# EAGLE design os22_rev_diy (EAGLE 7.1.0)
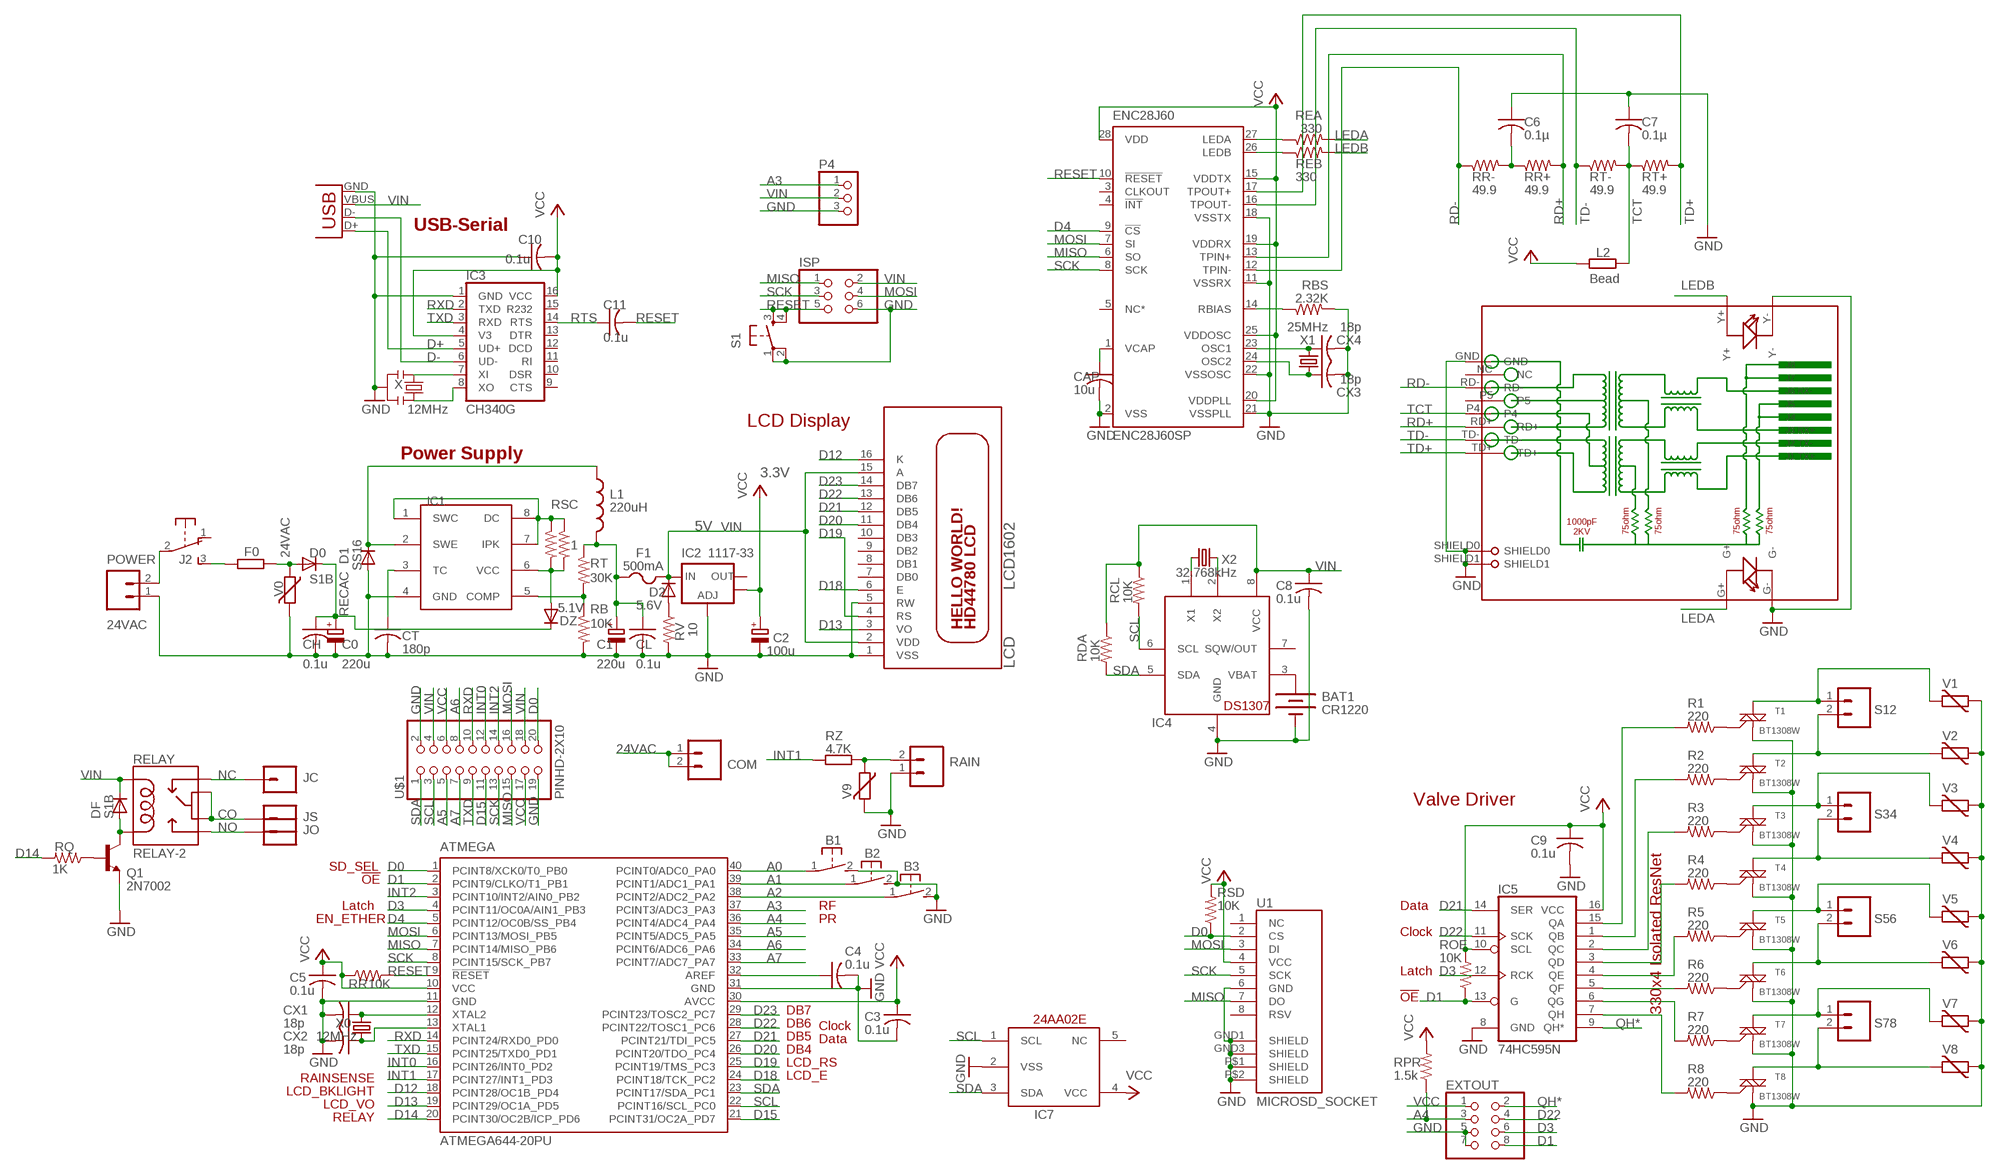
[diagram p0: schematic, sheet 1]

## Parts
ATMEGA  ATMEGA644-20PU  [DIL40]
B1  31-XX  [B3F-31XX]
B2  31-XX  [B3F-31XX]
B3  31-XX  [B3F-31XX]
BAT1  CR1220  BATTERYBATTERY_12MM_SMT  [BATTCON_12MM_SMT]
C0  220u  CPOL-EUE3.5-8  [E3,5-8]
C1  220u  CPOL-EUE3.5-8  [E3,5-8]
C2  100u  CPOL-EUE2-5  [E2-5]
C3  0.1u  C-USC0603K  [C0603K]
C4  0.1u  C-USC0603K  [C0603K]
C5  0.1u  C-USC0603K  [C0603K]
C6  0.1µ  C-USC0603K  [C0603K]
C7  0.1µ  C-USC0603K  [C0603K]
C8  0.1u  C-USC0603K  [C0603K]
C9  0.1u  C-USC0603K  [C0603K]
C10  0.1u  C-USC0603K  [C0603K]
C11  0.1u  C-USC0603K  [C0603K]
CAP  10u  C-USC0805K  [C0805K]
CH  0.1u  C-USC0603K  [C0603K]
CL  0.1u  C-USC0603K  [C0603K]
COM  M025MM-X  [SCREWTERMINAL-5MM-2-X]
CT  180p  C-USC0603K  [C0603K]
CX1  18p  C-USC0603K  [C0603K]
CX2  18p  C-USC0603K  [C0603K]
CX3  18p  C-USC0603K  [C0603K]
CX4  18p  C-USC0603K  [C0603K]
D0  S1B  DIODE-DO-214AC  [DO-214AC]
D1  SS16  DIODE-DO-214AC  [DO-214AC]
D2  5.6V  DIODE-MINIMELF  [MINIMELF]
DF  S1B  DIODE-DO-214AC  [DO-214AC]
DZ  5.1V  DIODE-MELF-MLL41  [MELF-MLL41]
ENC28J60  ENC28J60SP  [DIL28-3]
EXTOUT  PINHD-2X4  [2X04]
F0  R-EU_0411/3V  [0411V]
F1  500mA  PTCFUSE-1812  [1812]
IC1  34063  MC33063/MC34063D  [SO08]
IC2  1117-33  V_REG_LM1117SOT223  [SOT223]
IC3  CH340G  [SO16]
IC4  DS1307  DS1307SOIC  [SO08]
IC5  74HC595N  74LS595D  [SO16]
IC7  24AA02E  24AA02E48  [SOT23-5L]
ISP  PINHD-2X3  [2X03]
J2  EG1206  [EG1206]
JC  M01PTH  [1X01]
JO  M01PTH  [1X01]
JS  M01PTH  [1X01]
L1  220uH  L-US0204/5  [0204/5]
L2  Bead  R-EU_R0805  [R0805]
LCD  LCD1602  HD44780LCDNOHOLE  [LCD1602A]
P4  PINHD-1X3  [1X03]
POWER  24VAC  M024MM-X  [SCREWTERMINAL-4MM-2-X]
Q1  2N7002  TRANSISTOR_NPNSOT23-3  [SOT23-3]
R1  220  R-US_R0603  [R0603]
R2  220  R-US_R0603  [R0603]
R3  220  R-US_R0603  [R0603]
R4  220  R-US_R0603  [R0603]
R5  220  R-US_R0603  [R0603]
R6  220  R-US_R0603  [R0603]
R7  220  R-US_R0603  [R0603]
R8  220  R-US_R0603  [R0603]
RAIN  M025MM-X  [SCREWTERMINAL-5MM-2-X]
RB  10K  R-US_R0805  [R0805]
RBS  2.32K  R-US_R0805  [R0805]
RCL  10K  R-US_R0603  [R0603]
RDA  10K  R-US_R0603  [R0603]
REA  330  R-US_R0603  [R0603]
REB  330  R-US_R0603  [R0603]
RELAY  RELAY-2  [RELAY-HK4100F]
RJ45  HR911105A  [HR911105A]
ROE  10K  R-US_R0603  [R0603]
RPR  1.5k  R-US_R0603  [R0603]
RQ  1K  R-US_R0603  [R0603]
RR  10K  R-US_R0603  [R0603]
RR+  49.9  R-US_R0805  [R0805]
RR-  49.9  R-US_R0805  [R0805]
RSC  1  R-US_R0805  [R0805]
RSC1  1  R-US_R0805  [R0805]
RSD  10K  R-US_R0603  [R0603]
RT  30K  R-US_R0805  [R0805]
RT+  49.9  R-US_R0805  [R0805]
RT-  49.9  R-US_R0805  [R0805]
RV  10  R-US_R0805  [R0805]
RZ  4.7K  R-EU_R0805  [R0805]
S1  TAC_SWITCHPTH  [TACTILE-PTH]
S12  M025MM-X  [SCREWTERMINAL-5MM-2-X]
S34  M025MM-X  [SCREWTERMINAL-5MM-2-X]
S56  M025MM-X  [SCREWTERMINAL-5MM-2-X]
S78  M025MM-X  [SCREWTERMINAL-5MM-2-X]
T1  BT1308W  MAC97  [TO-92]
T2  BT1308W  MAC97  [TO-92]
T3  BT1308W  MAC97  [TO-92]
T4  BT1308W  MAC97  [TO-92]
T5  BT1308W  MAC97  [TO-92]
T6  BT1308W  MAC97  [TO-92]
T7  BT1308W  MAC97  [TO-92]
T8  BT1308W  MAC97  [TO-92]
U1  MICROSD_SOCKET  USD-SOCKETMICRO-SD-SOCKET-TAOBAO  [MICRO-SD-SOCKET-TAOBAO]
U$1  PINHD-2X10  [2X10-CLEANBIG]
USB  USBPTH  [USB-B-PTH]
V0  MOV  VARISTOR-5  [R-5]
V1  MOV  VARISTOR-5  [R-5]
V2  MOV  VARISTOR-5  [R-5]
V3  MOV  VARISTOR-5  [R-5]
V4  MOV  VARISTOR-5  [R-5]
V5  MOV  VARISTOR-5  [R-5]
V6  MOV  VARISTOR-5  [R-5]
V7  MOV  VARISTOR-5  [R-5]
V8  MOV  VARISTOR-5  [R-5]
V9  MOV  VARISTOR-5  [R-5]
X  12MHz  RESONATORSMD  [RESONATOR-SMD]
X0  12MHz  CRYSTALHC49UV  [HC49U-V]
X1  25MHz  CRYSTALHC49UV  [HC49U-V]
X2  32.768kHz  CRYSTALTC38H  [TC38H]

## Nets
24VAC [power]: COM.1 COM.2 D0.A F0.2 V0.1
A0: ATMEGA.40(PCINT0/ADC0_PA0) B1.1(P)
A1: ATMEGA.39(PCINT1/ADC1_PA1) B2.1(P)
A2: ATMEGA.38(PCINT2/ADC2_PA2) B3.1(P)
A3: ATMEGA.37(PCINT3/ADC3_PA3) P4.1
A4: ATMEGA.36(PCINT4/ADC4_PA4) EXTOUT.3 RPR.1
A5: ATMEGA.35(PCINT5/ADC5_PA5) U$1.5
A6: ATMEGA.34(PCINT6/ADC6_PA6) U$1.8
A7: ATMEGA.33(PCINT7/ADC7_PA7) U$1.7
AREF: ATMEGA.32(AREF) C4.1
CO [relaypower]: JS.1 RELAY.5 RELAY.6
D0: ATMEGA.1(PCINT8/XCK0/T0_PB0) RSD.1 U1.2(CS) U$1.20
D1: ATMEGA.2(PCINT9/CLKO/T1_PB1) EXTOUT.8 IC5.13(G) ROE.1
D3: ATMEGA.4(PCINT11/OC0A/AIN1_PB3) EXTOUT.6 IC5.12(RCK)
D4: ATMEGA.5(PCINT12/OC0B/SS_PB4) ENC28J60.9(!CS)
D12: ATMEGA.18(PCINT28/OC1B_PD4) LCD.16(K)
D13: ATMEGA.19(PCINT29/OC1A_PD5) LCD.3(VO)
D14: ATMEGA.20(PCINT30/OC2B/ICP_PD6) RQ.2
D15: ATMEGA.21(PCINT31/OC2A_PD7) U$1.11
D18: ATMEGA.24(PCINT18/TCK_PC2) LCD.6(E)
D19: ATMEGA.25(PCINT19/TMS_PC3) LCD.4(RS)
D20: ATMEGA.26(PCINT20/TDO_PC4) LCD.11(DB4)
D21: ATMEGA.27(PCINT21/TDI_PC5) IC5.14(SER) LCD.12(DB5)
D22: ATMEGA.28(PCINT22/TOSC1_PC6) EXTOUT.4 IC5.11(SCK) LCD.13(DB6)
D23: ATMEGA.29(PCINT23/TOSC2_PC7) LCD.14(DB7)
D+: IC3.5(UD+) USB.D+
D-: IC3.6(UD-) USB.D-
GND [power]: ATMEGA.11(GND) ATMEGA.31(GND) B1.2(S) B2.2(S) B3.2(S) BAT1.P$1(-) C0.- C1.- C2.- C3.2 C4.2 C5.2 C6.1 C7.1 C8.2 C9.2 C10.1 CAP.2 CH.2 CL.2 CT.2 CX1.2 CX2.2 CX3.2 CX4.2 D1.A ENC28J60.2(VSS) ENC28J60.11(VSSRX) ENC28J60.18(VSSTX) ENC28J60.21(VSSPLL) ENC28J60.22(VSSOSC) EXTOUT.5 EXTOUT.7 IC1.4(GND) IC2.1(ADJ) IC3.1(GND) IC4.4(GND) IC5.8(GND) IC7.2(VSS) ISP.6 LCD.1(VSS) LCD.5(RW) P4.3 POWER.1 Q1.2(E) RAIN.1 RB.2 RBS.2 RJ45.G- RJ45.GND RJ45.SHIELD0 RJ45.SHIELD1 RJ45.Y- RV.2 S1.1 S1.2 T1.1(M1) T2.1(M1) T3.1(M1) T4.1(M1) T5.1(M1) T6.1(M1) T7.1(M1) T8.1(M1) U1.6(GND) U1.GND1(SHIELD) U1.GND3(SHIELD) U1.P$1(SHIELD) U1.P$2(SHIELD) U$1.2 U$1.19 USB.GND V0.2 V1.1 V2.1 V3.1 V4.1 V5.1 V6.1 V7.1 V8.1 V9.2 X.2
INT0: ATMEGA.16(PCINT26/INT0_PD2) U$1.12
INT1: ATMEGA.17(PCINT27/INT1_PD3) RZ.2
INT2: ATMEGA.3(PCINT10/INT2/AIN0_PB2) U$1.14
LEDA: REA.2 RJ45.G+
LEDB: REB.2 RJ45.Y+
MISO: ATMEGA.7(PCINT14/MISO_PB6) ENC28J60.6(SO) ISP.1 U1.7(DO) U$1.15
MOSI: ATMEGA.6(PCINT13/MOSI_PB5) ENC28J60.7(SI) ISP.4 U1.3(DI) U$1.16
N$1: IC4.2(X2) X2.2
N$2: IC4.1(X1) X2.1
N$3: R1.1 T1.2(G)
N$4: IC5.5(QF) R6.2
N$5: IC5.6(QG) R7.2
N$6 [power]: J2.2(P) POWER.2
N$7: IC5.7(QH) R8.2
N$8: BAT1.P$2(+) IC4.3(VBAT)
N$9 [power]: D1.C IC1.2(SWE) L1.1
N$10: IC5.4(QE) R5.2
N$11: IC5.3(QD) R4.2
N$12: IC5.2(QC) R3.2
N$13: IC5.1(QB) R2.2
N$14: IC5.15(QA) R1.2
N$15: R2.1 T2.2(G)
N$16 [power]: S12.1 T1.3(M2) V1.2
N$17 [power]: S12.2 T2.3(M2) V2.2
N$18 [power]: S34.1 T3.3(M2) V3.2
N$19: ENC28J60.14(RBIAS) RBS.1
N$20 [power]: S34.2 T4.3(M2) V4.2
N$21: R3.1 T3.2(G)
N$22 [power]: S56.1 T5.3(M2) V5.2
N$23 [power]: S56.2 T6.3(M2) V6.2
N$24 [power]: S78.1 T7.3(M2) V7.2
N$25 [power]: S78.2 T8.3(M2) V8.2
N$26: R4.1 T4.2(G)
N$27: R5.1 T5.2(G)
N$28: R6.1 T6.2(G)
N$29: R7.1 T7.2(G)
N$31: RAIN.2 RZ.1 V9.1
N$32 [power]: F0.1 J2.3(S)
N$33: CAP.1 ENC28J60.1(VCAP)
N$34: ENC28J60.27(LEDA) REA.1
N$35: DF.A Q1.3(C) RELAY.9
N$37: ENC28J60.26(LEDB) REB.1
N$38 [power]: DZ.A IC1.6(VCC) RSC1.2 RSC.2
N$39: D2.A RV.1
N$40: Q1.1(B) RQ.1
N$41: CX3.1 ENC28J60.24(OSC2) X1.2
N$42: CX4.1 ENC28J60.23(OSC1) X1.1
N$43: R8.1 T8.2(G)
N$44: IC3.7(XI) X.1
N$45 [power]: IC1.1(SWC) IC1.7(IPK) IC1.8(DC) RSC1.1 RSC.1
N$46: ATMEGA.12(XTAL2) CX1.1 X0.2
N$47: ATMEGA.13(XTAL1) CX2.1 X0.1
N$48: IC3.8(XO) X.3
N$49: CT.1 IC1.3(TC)
N$54: C6.2 RR+.1 RR-.2
N$55: IC1.5(COMP) RB.1 RT.2
NC [relaypower]: JC.1 RELAY.1
NO [relaypower]: JO.1 RELAY.10
QH*: EXTOUT.2 IC5.9(QH*)
RD+: ENC28J60.13(TPIN+) RJ45.RD+ RR+.2
RD-: ENC28J60.12(TPIN-) RJ45.RD- RR-.1
RECAC [power]: C0.+ CH.1 D0.C DZ.C
RESET: ATMEGA.9(!RESET) C11.2 ENC28J60.10(!RESET) ISP.5 RR.2 S1.3 S1.4
RTS: C11.1 IC3.14(RTS)
RXD: ATMEGA.14(PCINT24/RXD0_PD0) IC3.2(TXD) U$1.10
SCK: ATMEGA.8(PCINT15/SCK_PB7) ENC28J60.8(SCK) ISP.3 U1.5(SCK) U$1.13
SCL: ATMEGA.22(PCINT16/SCL_PC0) IC4.6(SCL) IC7.1(SCL) RCL.2 U$1.3
SDA: ATMEGA.23(PCINT17/SDA_PC1) IC4.5(SDA) IC7.3(SDA) RDA.2 U$1.1
TCT: C7.2 L2.1 RJ45.P4 RT+.1 RT-.2
TD+: ENC28J60.17(TPOUT+) RJ45.TD+ RT+.2
TD-: ENC28J60.16(TPOUT-) RJ45.TD- RT-.1
TXD: ATMEGA.15(PCINT25/TXD0_PD1) IC3.3(RXD) U$1.9
VCC: ATMEGA.10(VCC) ATMEGA.30(AVCC) C2.+ C3.1 C5.1 C9.1 C10.2 ENC28J60.15(VDDTX) ENC28J60.19(VDDRX) ENC28J60.20(VDDPLL) ENC28J60.25(VDDOSC) ENC28J60.28(VDD) EXTOUT.1 IC2.4(OUT) IC3.4(V3) IC3.16(VCC) IC5.10(SCL) IC5.16(VCC) IC7.4(VCC) L2.2 ROE.2 RPR.2 RR.1 RSD.2 U1.4(VCC) U$1.6 U$1.17
VIN [power]: C8.1 D2.C DF.C F1.2 IC2.3(IN) IC4.8(VCC) ISP.2 LCD.2(VDD) LCD.15(A) P4.2 RCL.1 RDA.1 RELAY.2 U$1.4 U$1.18 USB.VBUS
VIN1 [power]: C1.+ CL.1 F1.1 L1.2 RT.1
Unconnected: ENC28J60.3(CLKOUT) ENC28J60.4(!INT) ENC28J60.5(NC*) IC2.2(OUT) IC3.9(CTS) IC3.10(DSR) IC3.11(RI) IC3.12(DCD) IC3.13(DTR) IC3.15(R232) IC4.7(SQW/OUT) IC7.5(NC) J2.1(O) LCD.7(DB0) LCD.8(DB1) LCD.9(DB2) LCD.10(DB3) RJ45.NC RJ45.P5 U1.1(NC) U1.8(RSV)

## Notes on the sheet
- USB-Serial
- LCD Display
- Power Supply
- 3.3V
- 5V
- Valve Driver
- SD_SEL
- !OE
- Latch | RF | Data
- EN_ETHER | PR
- Clock
- Latch
- !OE
- DB7 | 330x4 Isolated ResNet
- Clock
- DB6
- Data
- DB5
- DB4
- LCD_RS
- RAINSENSE
- LCD_E
- LCD_BKLIGHT
- LCD_VO
- RELAY

## Library data of the parts
ATMEGA = atmel:ATMEGA644-*PU: 8-bit Microcontroller with 64K Bytes In-System Programmable Flash Auto generated by make-symbol-device-package-bsdl.ulp Rev. 34 Source: http://www.atmel.com/dyn/resources/prod_documents/doc2593.pdf; MPN: ATMEGA644-20PU; OC_FARNELL: 1288340; OC_NEWARK: 23M5060
B1-B3 = adafruit:31-XX: OMRON SWITCH Now with beefier pads!
BAT1 = SparkFunNew:BATTERY: Battery Holders Various common sizes : AA, AAA, 20mm coin cell and 12mm coin cell.
C0 C1 C2 = resistor:CPOL-EU: POLARIZED CAPACITOR, European symbol
C3-C9 CAP CH CL CX1-CX4 = adafruit2013:C-US: CAPACITOR, American symbol
C10 C11 CT = adafruit:C-US: CAPACITOR, American symbol
COM POWER RAIN S12 S34 S56 S78 = SparkFun:M02: Header 2 Standard 2-pin 0.1" header. Use with straight break away headers (SKU : PRT-00116), right angle break away headers (PRT-00553), swiss pins (PRT-00743), machine pins (PRT-00117), and female headers (PRT-00115). Molex polarized connector foot print use with SKU : PRT-08233 with associated crimp pins and housings.
D0 D1 D2 DF DZ = diode:DIODE-: DIODE
ENC28J60 = microchip:ENC28J60: Stand-Alone Ethernet Controller with SPI Interface Source: http://ww1.microchip.com/downloads/en/DeviceDoc/39662c.pdf; MF: MICROCHIP; MPN: ENC28J60/SP; OC_FARNELL: 1084619; OC_NEWARK: 96K3661
EXTOUT = pinhead:PINHD-2X4: PIN HEADER
F0 L2 RZ = rcl:R-EU_: RESISTOR, European symbol
F1 = adafruit:PTCFUSE: PTC fuses, resettable thermistors
IC1 = adafruit:MC33063/MC34063: MC33063 and MC34063 Basic DC/DC converter with internal power-NPN transistor, 100KHz, 1.5A peak switch current. 3-40 input/output.
IC2 = SparkFun:V_REG_LM1117: Voltage Regulator LM1117 Standard adjustable voltage regulator but in SMD form. Spark Fun Electronics SKU : COM-00595
IC3 = SparkFunNew:CH340
IC4 = adafruit:DS1307: DS1307 Real time clock (RTC) with battery backup ability. Talk to it via i2c
IC5 = SparkFun:74*595: 8-bit SHIFT REGISTER, output latch
IC7 = adafruit:24AA02E48
ISP = pinhead:PINHD-2X3: PIN HEADER
J2 = adafruit:EG1206
JC JO JS = SparkFun:M01: Header 1 Standard 1-pin 0.1" header. Use with straight break away headers (SKU : PRT-00116), right angle break away headers (PRT-00553), swiss pins (PRT-00743), machine pins (PRT-00117), and female headers (PRT-00115).
L1 = rcl:L-US: INDUCTOR, American symbol
LCD = adafruit:HD44780LCD: HD44780 LCD Standard character type LCDs, available in sizes from 8x1 to 40x4!
P4 = pinhead:PINHD-1X3: PIN HEADER
Q1 = SparkFunNew:TRANSISTOR_NPN: Transistor NPN BJT configuration in SOT23 package. MMBT2222 is the common NPN we use. Double check BCE configuration again layout.
R1-R7 RCL RDA ROE RPR RQ RR RSD RV = adafruit:R-US_: RESISTOR, American symbol
R8 RBS REA REB RR+ RR- RT+ RT- = adafruit2013:R-US_: RESISTOR, American symbol
RB RSC RSC1 RT = adafruitGood:R-US_: RESISTOR, American symbol
RELAY = SparkFunNew:RELAY-2
RJ45 = CONNECTER:HR911105A
S1 = SparkFunNew:TAC_SWITCH: Momentary Switch Button commonly used for reset or general input. Spark Fun Electronics SKU : COM-00097
T1-T8 = SparkFun:MAC97: MAC97 Triac http://www.onsemi.com/pub_link/Collateral/MAC97-D.PDF
U1 = SparkFunNew:USD-SOCKET: microSD Socket Push-push type uSD socket. Schematic element and footprint production proven. Spark Fun Electronics SKU : PRT-00127. tDoc lines correctly indicate media card edge positions when inserting (unlocked, locked, depressed).
U$1 = adafruit:PINHD-2X10
USB = SparkFunNew:USB: USB Connectors USB-B-PTH is fully proven SKU : PRT-00139 USB-miniB is fully proven SKU : PRT-00587 USB-A-PCB is untested. USB-A-H is throughly reviewed, but untested. Spark Fun Electronics SKU : PRT-00437 USB-B-SMT is throughly reviewed, but untested. Needs silkscreen touching up. USB-A-S has not been used/tested USB-MB-H has not been used/tested
V0 V1-V9 = varistor:VARISTOR: VARISTOR
X = SparkFunNew:RESONATOR: Resonator Small SMD resonator. This is the itty bitty 10/20MHz resonators with built in caps. CSTCE10M0G55 and CSTCE20M0V53. Footprint has been reviewed closely but hasn't been tested yet.
X0 X1 = SparkFun:CRYSTAL: Crystals Various standard crystals. Proven footprints. Spark Fun Electronics SKU : COM-00534
X2 = crystal:CRYSTAL: CRYSTAL; OC_FARNELL: unknown; OC_NEWARK: unknown

## Net classes
0 default: width 0.203 mm, clearance 0.203 mm
1 power: width 0.305 mm, clearance 0.203 mm
2 relaypower: width 0.508 mm, clearance 0.305 mm

## Board
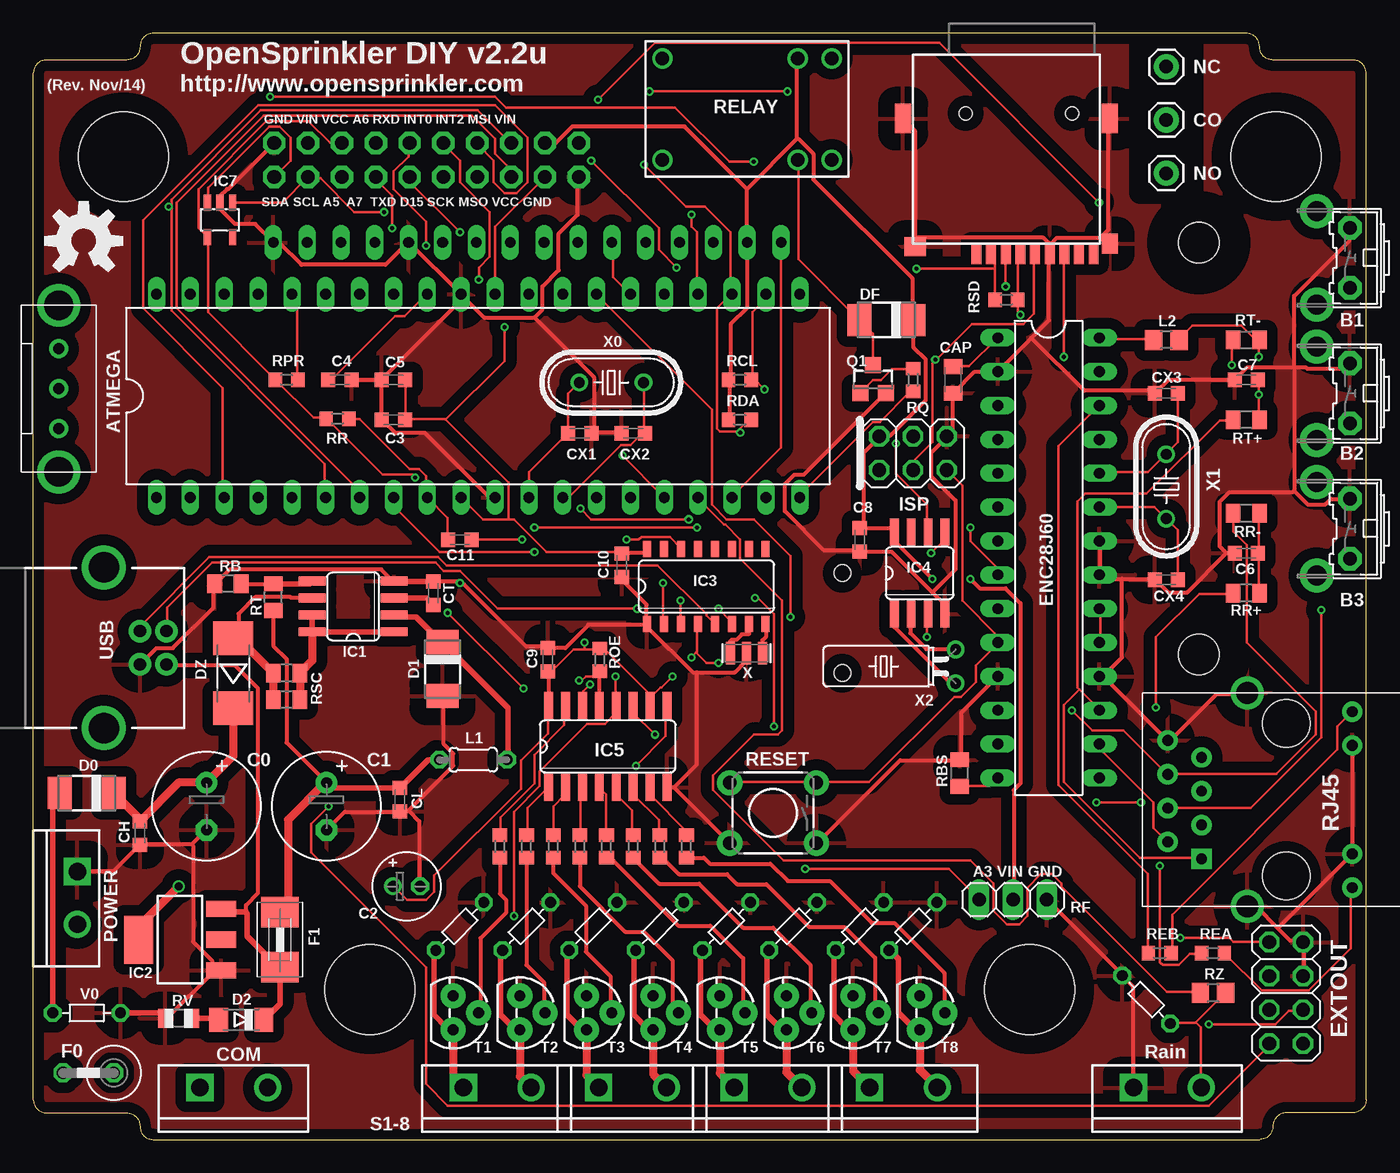
[diagram p1: board, top side]
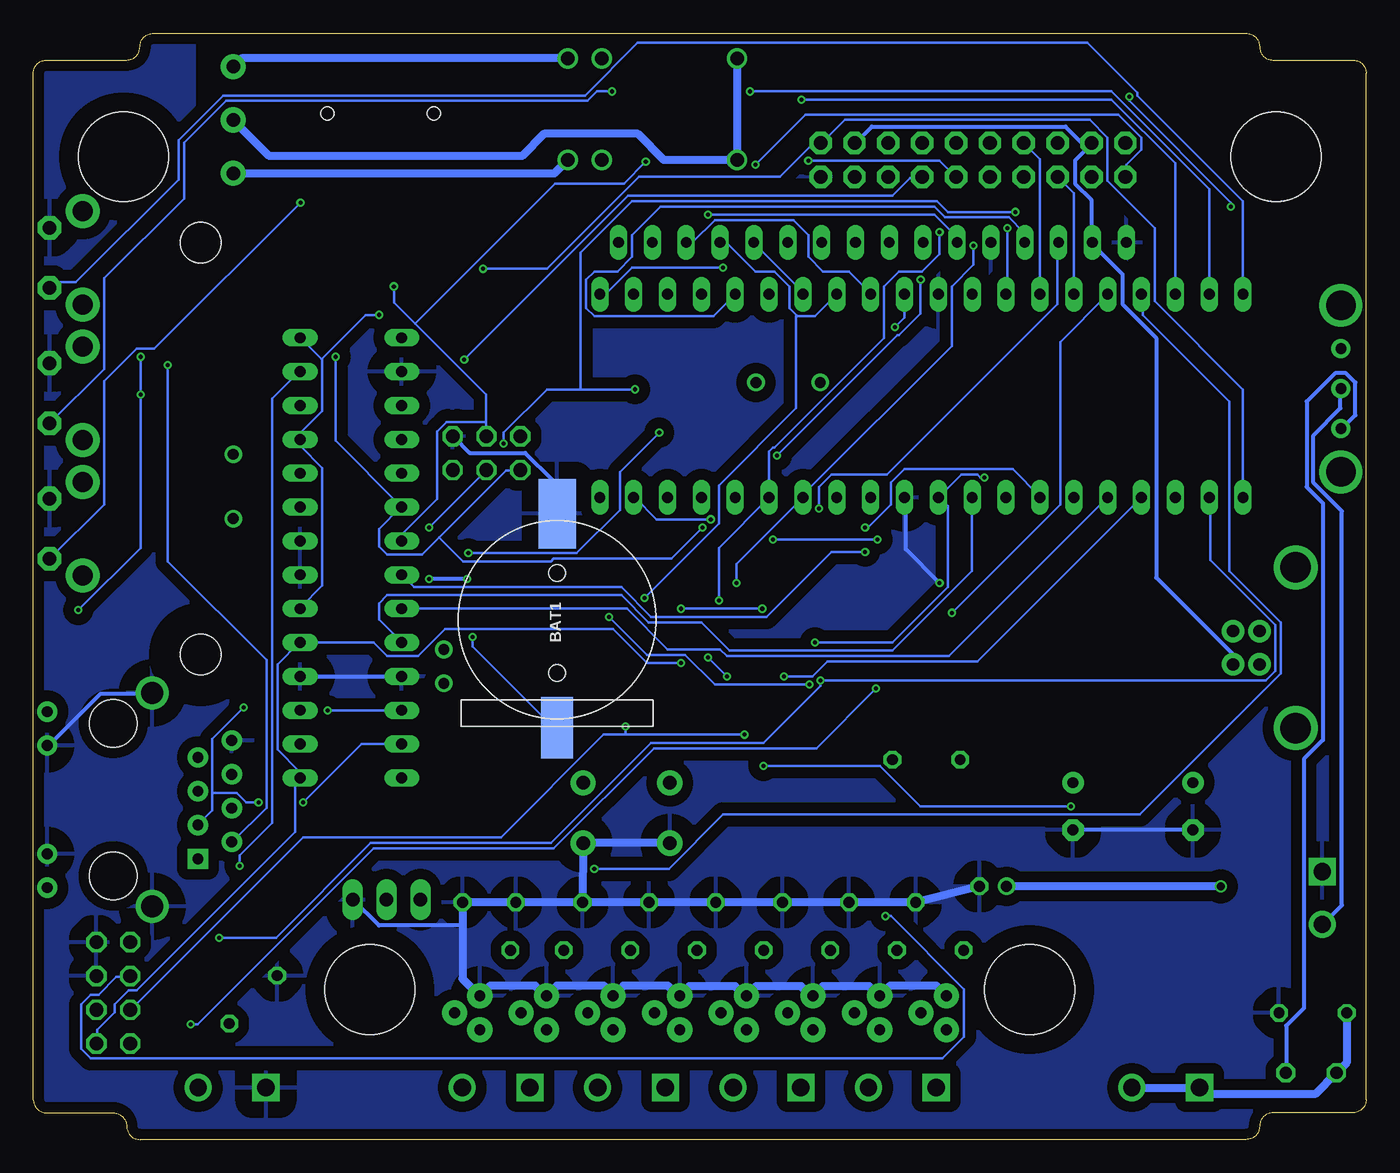
[diagram p2: board, bottom side, seen from below]

Size 100 x 83 mm. Coordinates in mm from the lower left corner, seen from the top.
Outline: 90,83 9,83 arc90 8,82 arc-90 7,81 1,81 arc90 0,80 0,3 arc90 1,2 7,2 arc-90 8,1 arc90 9,0 92,0 arc90 93,1 arc-90 94,2 99,2 arc90 100,3 100,80 arc90 99,81 93,81 arc-90 92,82 arc90 91,83 90,83
Copper layers (1*16): Top 0.035mm / dielectric 1.5mm / Bottom 0.035mm
Design rules "Fusion_eagle_rule_v1.1 *": minimum track width 6mil, minimum drill 12mil, track to track 6mil, track to pad 6mil, pad to pad 6mil, via to via 6mil, smd to smd 0mil, copper to edge 10mil, drill to drill 10mil, minimum pad ring 10mil, minimum via ring 6mil, stop-mask expansion 2mil, vias tented up to drill 100mil, thermal gap 50mil
Holes 3.05 mm at 87.46,67.3 87.46,36.38
Holes 6.75 mm at 6.76,73.74 93.24,73.74 25.26,11.26 74.74,11.26
tRestrict: area 84.4,33.3 to 90.5,39.4; area 84.4,64.2 to 90.5,70.3; area 2.8,69.7 to 10.8,77.7; area 89.2,69.7 to 97.2,77.7; area 21.3,7.3 to 29.3,15.3; area 70.7,7.3 to 78.7,15.3; area 83,71 to 87,82
bRestrict: area 2.8,69.7 to 10.8,77.7; area 89.2,69.7 to 97.2,77.7; area 21.3,7.3 to 29.3,15.3; area 70.7,7.3 to 78.7,15.3; area 84.4,64.2 to 90.5,70.3; area 84.4,33.3 to 90.5,39.4; area 83,71 to 87,82
vRestrict: area 70,19.5 to 77,20.5; area 17.3,76.2 to 39.3,76.9; area 17.1,70 to 42.6,70.7

### Footprints (pad centres in the part's own frame; a part is rotated, then mirrored left to right if it is on the bottom)
DIL40 = drill 0.813 long: 1 -24.13,-7.62; 2 -21.59,-7.62; 3 -19.05,-7.62; 4 -16.51,-7.62; 5 -13.97,-7.62; 6 -11.43,-7.62; 7 -8.89,-7.62; 8 -6.35,-7.62; 9 -3.81,-7.62; 10 -1.27,-7.62; 11 1.27,-7.62; 12 3.81,-7.62; 13 6.35,-7.62; 14 8.89,-7.62; 15 11.43,-7.62; 16 13.97,-7.62; 17 16.51,-7.62; 18 19.05,-7.62; 19 21.59,-7.62; 20 24.13,-7.62; 21 24.13,7.62; 22 21.59,7.62; 23 19.05,7.62; 24 16.51,7.62; 25 13.97,7.62; 26 11.43,7.62; 27 8.89,7.62; 28 6.35,7.62; 29 3.81,7.62; 30 1.27,7.62; 31 -1.27,7.62; 32 -3.81,7.62; 33 -6.35,7.62; 34 -8.89,7.62; 35 -11.43,7.62; 36 -13.97,7.62; 37 -16.51,7.62; 38 -19.05,7.62; 39 -21.59,7.62; 40 -24.13,7.62
B3F-31XX = drill 1.016 pad 1.778 octagon: 1 -2.261,-1.245; 2 2.261,-1.245 | drill 1.499 pad 2.54: 3 -3.505,1.245; 4 3.505,1.245
BATTCON_12MM_SMT = smd 2.8 x 5.2: P$1 0,11.96 | smd 2.4 x 4.6: P$2 0,-4.1 | hole 1.25: 0,7.5; 0,0
E3,5-8 = drill 0.813 pad 1.6: + -1.778,0 | drill 0.813 pad 1.6 octagon: - 1.778,0
E2-5 = drill 0.813 pad 1.27: + -1.016,0 | drill 0.813 pad 1.27 octagon: - 1.016,0
C0603K = smd 1.05 x 1.08: 1 -0.875,0; 2 0.875,0
C0805K = smd 1.1 x 1.4: 1 -1,0; 2 1,0
SCREWTERMINAL-5MM-2-X = drill 1.3 pad 2.032 square: 1 0,0 | drill 1.3 pad 2.032: 2 5.08,0
DO-214AC = smd 1.8 x 2.4: A 2.025,0; C -2.025,0
MINIMELF = smd 1.4 x 1.8: A 1.7,0; C -1.7,0
MELF-MLL41 = smd 2.5 x 3: A 2.625,0; C -2.625,0
DIL28-3 = drill 0.813 long: 1 -16.51,-3.81; 2 -13.97,-3.81; 3 -11.43,-3.81; 4 -8.89,-3.81; 5 -6.35,-3.81; 6 -3.81,-3.81; 7 -1.27,-3.81; 8 1.27,-3.81; 9 3.81,-3.81; 10 6.35,-3.81; 11 8.89,-3.81; 12 11.43,-3.81; 13 13.97,-3.81; 14 16.51,-3.81; 15 16.51,3.81; 16 13.97,3.81; 17 11.43,3.81; 18 8.89,3.81; 19 6.35,3.81; 20 3.81,3.81; 21 1.27,3.81; 22 -1.27,3.81; 23 -3.81,3.81; 24 -6.35,3.81; 25 -8.89,3.81; 26 -11.43,3.81; 27 -13.97,3.81; 28 -16.51,3.81
2X04 = drill 1.016 octagon: 1 -3.81,-1.27; 2 -3.81,1.27; 3 -1.27,-1.27; 4 -1.27,1.27; 5 1.27,-1.27; 6 1.27,1.27; 7 3.81,-1.27; 8 3.81,1.27
0411V = drill 0.914 octagon: 1 -2.54,0; 2 1.27,0
1812 = smd 2.286 x 2.794: 1 -2.046,0; 2 2.046,0
SO08 = smd 0.66 x 2.032: 1 -1.905,-3.073; 2 -0.635,-3.073; 3 0.635,-3.073; 4 1.905,-3.073; 5 1.905,3.073; 6 0.635,3.073; 7 -0.635,3.073; 8 -1.905,3.073
SOT223 = smd 1.219 x 2.235: 1 -2.311,-3.099; 2 0,-3.099; 3 2.311,-3.099 | smd 3.6 x 2.2: 4 0,3.099
SO16 = smd 0.6 x 1.2: 1 -4.445,-2.8; 2 -3.175,-2.8; 3 -1.905,-2.8; 4 -0.635,-2.8; 5 0.635,-2.8; 6 1.905,-2.8; 7 3.175,-2.8; 8 4.445,-2.8; 9 4.445,2.8; 10 3.175,2.8; 11 1.905,2.8; 12 0.635,2.8; 13 -0.635,2.8; 14 -1.905,2.8; 15 -3.175,2.8; 16 -4.445,2.8
SO16' = smd 0.66 x 2.032: 1 -4.445,-3.073; 2 -3.175,-3.073; 3 -1.905,-3.073; 4 -0.635,-3.073; 5 0.635,-3.073; 6 1.905,-3.073; 7 3.175,-3.073; 8 4.445,-3.073; 9 4.445,3.073; 10 3.175,3.073; 11 1.905,3.073; 12 0.635,3.073; 13 -0.635,3.073; 14 -1.905,3.073; 15 -3.175,3.073; 16 -4.445,3.073
SOT23-5L = smd 0.55 x 1.2: 1 -0.95,-1.3; 2 0,-1.3; 3 0.95,-1.3; 4 0.95,1.3; 5 -0.95,1.3
2X03 = drill 1.016 octagon: 1 -2.54,-1.27; 2 -2.54,1.27; 3 0,-1.27; 4 0,1.27; 5 2.54,-1.27; 6 2.54,1.27
EG1206 = drill 0.8 pad 1.422: 1 -3,0; 2 0,0; 3 3,0 | drill 2.2: MT1 -6.25,0; MT2 6.25,0
1X01 = drill 1.016 pad 1.88: 1 0,0
0204/5 = drill 0.813 octagon: 1 -2.54,0; 2 2.54,0
R0805 = smd 1.3 x 1.5: 1 -0.95,0; 2 0.95,0
LCD1602A = drill 0.8 long: 1 8,33.46; 2 10.54,33.46; 3 13.08,33.46; 4 15.62,33.46; 5 18.16,33.46; 6 20.7,33.46; 7 23.24,33.46; 8 25.78,33.46; 9 28.32,33.46; 10 30.86,33.46; 11 33.4,33.46; 12 35.94,33.46; 13 38.48,33.46; 14 41.02,33.46; 15 43.56,33.46; 16 46.1,33.46
1X03 = drill 1.016 long: 1 -2.54,0; 2 0,0; 3 2.54,0
SCREWTERMINAL-4MM-2-X = drill 1.3 pad 2.032 square: 1 0,0 | drill 1.3 pad 2.032: 2 3.96,0
SOT23-3 = smd 1.2 x 1.2: 1 -0.95,-1; 2 0.95,-1; 3 0,1.1
R0603 = smd 1 x 1.1: 1 -0.85,0; 2 0.85,0
R0805' = smd 1.1 x 1.4: 1 -1,0; 2 1,0
RELAY-HK4100F = drill 1.016: 1 12.7,7.62; 2 10.16,7.62; 5 0,7.62; 6 0,0; 9 10.16,0; 10 12.7,0
HR911105A = drill 0.813 pad 1.524: G+ 4.953,-6.604; G- 4.953,-4.064; GND -8.89,4.445; NC -6.35,3.175; P4 -8.89,-0.635; P5 -6.35,0.635; RD+ -6.35,-1.905; RD- -8.89,1.905; TD- -8.89,-3.175; Y+ 4.953,6.604; Y- 4.953,4.064 | drill 1.651 pad 2.159: SHIELD0 -2.921,8.001; SHIELD1 -2.921,-8.001 | drill 0.813 pad 1.524 square: TD+ -6.35,-4.445 | hole 3.556: 0,-5.715; 0,5.715
TACTILE-PTH = drill 1.016 pad 1.88: 1 -3.251,2.261; 2 3.251,2.261; 3 -3.251,-2.261; 4 3.251,-2.261
TO-92 = drill 0.813 pad 1.88: 1 -1.27,0; 2 0,1.905; 3 1.27,0
MICRO-SD-SOCKET-TAOBAO = smd 0.75 x 1.6: 1 2.25,10.5; 2 1.15,10.5; 3 0.05,10.5; 4 -1.05,10.5; 5 -2.15,10.5; 6 -3.25,10.5; 7 -4.35,10.5; 8 -5.45,10.5 | smd 0.7 x 1.6: CD -6.55,10.5 | smd 1.2 x 1.5: GND1 -7.75,9.8 | smd 1.6 x 1.4: GND3 6.85,10 | smd 1.2 x 2.2: P$1 7.75,0.4; P$2 -7.75,0.4 | hole 1: 3.05,0; -4.93,0
2X10-CLEANBIG = drill 1.016 pad 1.676 octagon: 1 -11.43,-1.27; 2 -11.43,1.27; 3 -8.89,-1.27; 4 -8.89,1.27; 5 -6.35,-1.27; 6 -6.35,1.27; 7 -3.81,-1.27; 8 -3.81,1.27; 9 -1.27,-1.27; 10 -1.27,1.27; 11 1.27,-1.27; 12 1.27,1.27; 13 3.81,-1.27; 14 3.81,1.27; 15 6.35,-1.27; 16 6.35,1.27; 17 8.89,-1.27; 18 8.89,1.27; 19 11.43,-1.27; 20 11.43,1.27
USB-B-PTH = drill 0.914 pad 1.676: D+ 0,1.25; D- 1.981,1.25; GND 0,-1.25; VBUS 1.981,-1.25 | drill 2.286: S1 -2.718,-6.02; S2 -2.718,6.02
R-5 = drill 0.813 octagon: 1 -2.54,0; 2 2.54,0
RESONATOR-SMD = smd 0.7 x 1.7: 1 -1.2,0; 2 0,0; 3 1.2,0
HC49U-V = drill 0.813: 1 -2.413,0; 2 2.413,0
TC38H = drill 0.813: 1 -1.27,0; 2 1.27,0

### Placement (x,y rotation side)
ATMEGA  33.37,55.8 0 top
B1  97.54,66.15 90 top
B2  97.54,55.99 90 top
B3  97.54,45.83 90 top
BAT1  60.7,35 0 bottom
C0  13,25 270 top
C1  22,25 270 top
C2  28,19 0 top
C3  27,54 180 top
C4  23,57 0 top
C5  27,57 180 top
C6  91,44 0 top
C7  91,57 0 top
C8  62,45 270 top
C9  38.6,36 90 top
C10  44.15,43.1 90 top
C11  32,45 180 top
CAP  69,57 270 top
CH  8,23 270 top
CL  27.5,25.5 270 top
COM  12.5,3.9 0 top
CT  30,41 90 top
CX1  41,53 0 top
CX2  45,53 180 top
CX3  85,56 180 top
CX4  85,42 180 top
D0  4,26 180 top
D1  30.7,35.3 270 top
D2  15.6,9 180 top
DF  64,61.5 180 top
DZ  15,35 90 top
ENC28J60  76.17,43.64 270 top
EXTOUT  94,11 90 top
F0  3.5,5 180 top
F1  18.5,15 270 top
IC1  24,40 90 top
IC2  11,15 90 top
IC3  50.5,41.5 0 top
IC4  66.5,42.5 0 top
IC5  74HC595N  [SO16']  43.1,29.5 0 top
IC7  14,69 180 top
ISP  66,51.5 0 top
J2  1.9,56.34 270 top
JC  85,80.5 0 top
JO  85,72.5 0 top
JS  85,76.5 0 top
L1  33,28.5 180 top
L2  85,60 180 top
LCD  10,33.84 0 top
P4  73.5,18 0 top
POWER  3.3,20.1 270 top
Q1  63,57 0 top
R1  35,22 90 top
R2  37,22 90 top
R3  39,22 90 top
R4  41,22 90 top
R5  43,22 90 top
R6  45,22 90 top
R7  47,22 90 top
R8  49,22 90 top
RAIN  82.55,3.9 0 top
RB  10K  [R0805']  14.6,41.7 180 top
RBS  2.32K  [R0805']  69.5,27.5 90 top
RCL  53,57 0 top
RDA  53,54 0 top
REA  88.5,14 0 top
REB  84.5,14 0 top
RELAY  47.2,73.5 0 top
RJ45  94,25.5 0 top
ROE  42.5,36 90 top
RPR  19,57 180 top
RQ  66,57 270 top
RR  22.82,54.08 0 top
RR+  49.9  [R0805']  91,41 180 top
RR-  49.9  [R0805']  91,47 0 top
RSC  1  [R0805']  19,35 180 top
RSC1  1  [R0805']  19,33 180 top
RSD  73,63 0 top
RT  30K  [R0805']  18,40.7 90 top
RT+  49.9  [R0805']  91,54 180 top
RT-  49.9  [R0805']  91,60 0 top
RV  10  [R0805']  10.9,9.1 180 top
RZ  88.5,11 180 top
S1  55.5,24.5 180 top
S12  32.26,3.9 0 top
S34  42.42,3.9 0 top
S56  52.58,3.9 0 top
S78  62.74,3.9 0 top
T1  31.5,9.5 270 top
T2  36.5,9.5 270 top
T3  41.5,9.5 270 top
T4  46.5,9.5 270 top
T5  51.5,9.5 270 top
T6  56.5,9.5 270 top
T7  61.5,9.5 270 top
T8  66.5,9.5 270 top
U1  73,77 180 top
U$1  29.5,73.5 0 top
USB  8,36.9 0 top
V0  4,9.5 0 top
V1  32,16 225 top
V2  37,16 225 top
V3  42,16 225 top
V4  47,16 225 top
V5  52,16 225 top
V6  57,16 225 top
V7  62,16 225 top
V8  66,16 225 top
V9  83.5,10.5 135 top
X  53.5,36.5 0 top
X0  43.37,56.8 180 top
X1  85,49 90 top
X2  69.2,35.5 90 top

### Tracks (layer width: path | path; a pad name or v marks a point on that pad's centre or on a via)
24VAC
  Top 0.406: V0.1 1.46,25.48 D0.A
  Bottom 0.305: COM.1 12.6,3.96 12.6,3.9
  Bottom 0.61: COM.2 12.6,3.9 COM.1 12.05,3.9 11.95,3.8 11.95,3.5 12,3.45 3.78,3.45 F0.2 1.46,5.77 V0.1
A0
  Bottom 0.203: ATMEGA.40 9.25,63.5 9.25,70.41 17.17,78.33 17.17,78.54 20.93,82.3 54.66,82.3 58.62,78.33 85.75,78.33 89.1,74.98 89.1,72.03 96.83,64.31 98.35,64.31 98.75,63.91 B1.1
A1  (via drill 0.3)
  Top 0.203: v56.59,78.64 v46.23,78.64
  Bottom 0.203: v46.23,78.64 19.1,78.64 11.79,71.32 11.79,63.5 ATMEGA.39 | v56.59,78.64 57.71,78.64 58.42,77.93 85.55,77.93 88.7,74.78 88.7,70.61 94.69,64.62 94.69,57.81 98.75,53.75 B2.1
A2  (via drill 0.3)
  Top 0.203: v42.37,78.03 46.63,82.3 67.97,82.3 v79.96,70.31
  Bottom 0.203: v42.37,78.03 19.1,78.03 14.33,73.25 14.33,63.5 ATMEGA.38 | v79.96,70.31 90.93,59.33 92.25,59.33 94.69,56.9 94.69,47.65 98.75,43.59 B3.1
A3  (via drill 0.3)
  Top 0.203: v57.91,20.32 68.68,20.32 70.92,18.09 P4.1
  Bottom 0.203: v57.91,20.32 52.32,20.32 48.26,24.38 16.97,24.38 6.4,34.95 6.4,38.81 10.26,42.67 10.26,55.37 16.76,61.87 16.76,63.4 ATMEGA.37
A4  (via drill 0.3)
  Top 0.203: RPR.1 19.81,57.1 19.81,62.99 19.41,63.4 ATMEGA.36 | v88.19,8.64 93.17,8.64 94.18,9.65 95.2,9.65 EXTOUT.3 | v31.09,39.52 v36.78,33.83
  Bottom 0.203: v88.19,8.64 87.68,8.64 74.47,21.84 60.96,21.84 53.44,29.36 41.25,29.36 v36.78,33.83 | v31.09,39.52 22.96,47.65 22.96,59.84 19.41,63.4 ATMEGA.36
A5
  Bottom 0.203: ATMEGA.35 21.95,63.5 21.95,71.02 23.06,72.14 U$1.5
A6
  Bottom 0.203: ATMEGA.34 24.49,63.5 24.49,73.56 25.6,74.68 U$1.8
A7  (via drill 0.3)
  Top 0.203: v26.92,68.38 26.92,70.81 25.6,72.14 U$1.7
  Bottom 0.203: v26.92,68.38 26.92,63.5 ATMEGA.33
AREF
  Top 0.203: C4.1 22.15,57.1 22.45,57.1 27.13,61.77 27.84,61.77 29.46,63.4 ATMEGA.32
CO
  Bottom 0.508: 47.65,73.46 | 47.65,73.46 RELAY.6
  Bottom 0.61: RELAY.5 47.2,73.7 47.65,73.25 47.65,73.46 47.65,73.75 | RELAY.6 52.7,73.5 54.65,75.45 61.7,75.45 63.35,73.8 82.3,73.8 JS.1
D0  (via drill 0.3)
  Top 0.203: 72.14,65.33 72.14,66.24 71.93,66.45 U1.2 | 72.14,65.33 72.14,63.09 RSD.1 | v66.24,65.33 72.14,65.33
  Bottom 0.203: ATMEGA.1 9.25,48.26 9.25,56.29 15.85,62.89 15.85,68.38 19.41,71.93 19.41,75.18 20.73,76.5 39.12,76.5 40.84,74.78 U$1.20 40.95,74.68 41.55,74.68 43.99,72.24 54.56,72.24 61.47,65.33 v66.24,65.33
D1  (via drill 0.3)
  Top 0.203: v40.95,34.44 41.15,34.44 41.45,34.75 42.37,34.75 ROE.1 | v86.06,15.14 89.71,15.14 90.02,14.83 92.66,14.83 EXTOUT.8
  Top 0.305: ROE.1 42.45,35.15 42.45,32.6 IC5.13
  Bottom 0.203: ATMEGA.2 11.68,48.16 11.68,43.48 6.81,38.61 6.81,35.15 7.52,34.44 v40.95,34.44 40.95,34.04 45.21,29.77 53.65,29.77 61.16,22.25 74.68,22.25 81.79,15.14 v86.06,15.14
D3  (via drill 0.3)
  Top 0.203: v43.69,34.75 43.69,32.61 IC5.12 43.69,32.51 43.69,32 42.88,31.19 41.55,31.19 38,27.64 38,26.52 36.07,24.59 v36.07,16.76
  Bottom 0.203: v43.69,34.75 41.55,34.75 40.44,35.87 29.16,35.87 16.87,48.16 ATMEGA.4 | v36.07,16.76 35.66,16.76 30.18,11.28 30.18,7.72 31.8,6.1 95.71,6.1 96.42,6.81 96.42,10.16 95.71,10.87 95.1,10.87 93.78,12.19 92.76,12.19 EXTOUT.6
D4
  Bottom 0.203: ENC28J60.9 72.34,39.83 55.47,39.83 52.43,36.78 48.46,36.78 47.95,36.27 31.29,36.27 19.41,48.16 ATMEGA.5
D12
  Top 0.203: LCD.16 56.08,67.26 56.08,51.92 52.43,48.26 ATMEGA.18
D13  (via drill 0.3)
  Top 0.203: v41.05,47.35 41.86,46.53 v49.17,46.53
  Bottom 0.203: v41.05,47.35 41.05,48.97 40.13,49.89 35.97,49.89 23.16,62.69 23.16,67.26 LCD.3 | v49.17,46.53 53.24,46.53 54.86,48.16 ATMEGA.19
D14
  Top 0.203: RQ.2 65.94,56.08 65.73,56.08 63.5,53.85 62.99,53.85 57.4,48.26 ATMEGA.20
D15  (via drill 0.3)
  Top 0.203: v48.26,65.43 46.94,66.75 46.94,68.38 v41.86,73.46
  Bottom 0.203: v48.26,65.43 55.07,65.43 57,63.5 57.4,63.5 ATMEGA.21 | v41.86,73.46 32,73.46 30.79,72.24 U$1.11
D18  (via drill 0.3)
  Top 0.203: v49.38,69.39 49.38,68.48 49.78,68.07 49.78,63.5 ATMEGA.24
  Bottom 0.203: v49.38,69.39 32.41,69.39 30.79,67.77 30.79,67.36 LCD.6
D19
  Bottom 0.203: LCD.4 25.7,67.36 25.7,68.07 26.82,69.19 31.6,69.19 32.41,70 52.93,70 55.07,67.87 55.07,66.24 56.19,65.13 57.91,65.13 58.52,64.52 58.52,62.38 57.91,61.77 48.97,61.77 47.35,63.4 ATMEGA.25
D20
  Top 0.203: LCD.11 43.48,67.26 43.48,64.72 44.7,63.5 ATMEGA.26
D21  (via drill 0.3)
  Top 0.203: v41.76,34.14 41.25,33.63 41.25,32.61 IC5.14 | v56.79,39.22 56.79,43.79 54.05,46.53 52.02,46.53 50.9,47.65 50.9,54.76 42.27,63.4 ATMEGA.27
  Bottom 0.203: v41.76,34.14 48.87,34.14 51.1,36.37 53.95,36.37 v56.79,39.22 | LCD.12 45.92,67.26 42.16,63.5 ATMEGA.27
D22  (via drill 0.3)
  Top 0.203: v46.63,30.38 45.01,32 45.01,32.51 IC5.11 | v54.15,40.64 54.36,40.64 55.58,39.42 v55.58,30.99
  Bottom 0.203: 42.72,61.82 42.67,61.77 41.35,61.77 39.73,63.4 ATMEGA.28 | 42.72,61.82 43.28,62.38 43.28,64.01 44.4,65.13 45.82,65.13 47.95,67.26 48.46,67.26 LCD.13 | 55.58,30.38 57.2,30.38 64.92,22.66 79.76,22.66 92.66,9.75 EXTOUT.4 | 55.58,30.38 v46.63,30.38 | v54.15,40.64 48.56,46.23 48.56,49.07 42.77,54.86 42.77,61.77 42.72,61.82 | 55.58,30.38 v55.58,30.99
D23
  Bottom 0.203: LCD.14 51,67.36 50.49,67.36 48.87,68.99 42.98,68.99 41.86,67.87 41.86,66.24 40.74,65.13 38.81,65.13 37.19,63.5 ATMEGA.29
D+
  Top 0.203: IC3.5 51.1,38.71 50.49,39.32 50.49,39.42 46.84,43.08 30.99,43.08 30.38,43.69 13.21,43.69 8.03,38.51 8.03,38.2 USB.D+
D-  (via drill 0.3)
  Top 0.203: v51.41,39.83 52.32,38.91 52.32,38.71 IC3.6 | v45.31,39.83 34.85,39.83 32,42.67 30.79,42.67 30.18,43.28 13.41,43.28 10.06,39.93 10.06,38.2 USB.D-
  Bottom 0.203: v45.31,39.83 v51.41,39.83
GND  (via drill 0.3)
  Top 0.305: 67.46,41.05 68.38,40.13 68.38,39.52 IC4.4 68.48,39.52 | 67.46,41.05 64.41,44.09 62.08,44.09 C8.2 61.87,44.2 59.33,44.2 56.39,47.14 56.39,49.17 57.1,49.89 57.81,49.89 63.91,55.98 Q1.2 | U1.P$1 65.33,76.5 66.14,75.69 66.14,67.06 U1.GND3 66.24,67.67 75.79,67.67 76.2,67.26 U1.6 | U1.6 76.3,66.55 76.3,67.16 76.81,67.67 80.06,67.67 80.47,67.26 80.67,67.26 U1.GND1 80.16,67.77 80.67,68.28 80.67,76.5 U1.P$2 | 74.88,60.15 72.44,57.71 ENC28J60.2 72.34,57.61 70.61,57.61 69.09,56.08 CAP.2 68.99,55.98 68.99,53.24 68.58,52.83 ISP.6 68.48,52.63 67.36,51.51 67.36,49.78 69.19,47.95 69.19,42.77 67.46,41.05 | 74.88,60.15 76.2,61.47 76.2,66.34 U1.6 | 94.59,57.91 95.5,57.91 95.61,57.81 98.35,57.81 98.75,58.22 B2.2 | 94.59,57.91 91.03,57.91 90.22,57.1 C7.1 85.14,57 84.23,56.08 CX3.2 84.12,56.19 78.84,56.19 74.88,60.15 | 94.59,48.67 95.61,47.65 96.93,47.65 97.33,48.06 98.75,48.06 B3.2 | 94.59,57.91 94.59,48.67 | 94.59,57.91 94.59,63.3 98.75,67.46 98.75,68.38 B1.2 | RJ45.Y- 98.96,29.46 RJ45.G- 98.86,21.34 93.37,15.85 | EXTOUT.5 95.3,12.29 95.3,14.73 EXTOUT.7 95.2,14.94 94.28,14.94 93.37,15.85 | 93.37,15.85 91.75,17.48 91.14,17.48 RJ45.SHIELD1 | 81.69,42.06 80.37,42.06 80.06,42.37 ENC28J60.21 80.06,42.47 80.06,44.91 ENC28J60.22 | 81.69,42.06 84.12,42.06 CX4.2 84.23,41.96 85.14,41.05 86.56,41.05 89.51,43.99 | 89.51,43.99 C6.1 | ENC28J60.11 72.34,34.75 69.6,32 69.6,28.55 RBS.2 69.39,28.45 65.02,28.45 58.83,22.25 S1.1 | RJ45.SHIELD0 91.03,33.43 88.8,33.43 85.24,29.87 RJ45.GND 85.04,29.97 80.26,34.75 80.06,34.75 ENC28J60.18 80.37,34.85 81.69,36.17 81.69,42.06
  Top 0.305: 89.51,43.99 89,44.5 89,47.85 89.71,48.56 94.49,48.56 94.59,48.67 | C5.2 26.11,54.05 C3.2 26.21,53.95 27.13,53.03 29.36,53.03 34.14,48.26 34.54,48.26 ATMEGA.11 | C4.2 26.01,57 C5.2 | U$1.2 17.98,74.68 14.63,71.32 14.53,71.32 14.02,70.81 14.02,70.41 IC7.2 14.02,70.21 14.02,69.8 15.14,68.68 16.66,68.68 17.98,67.36 LCD.1 18.09,67.26 18.49,67.26 20.12,65.63 26.42,65.63 28.04,67.26 LCD.5 28.25,67.26 32,63.5 ATMEGA.31 | CX2.2 44.09,53.03 41.96,53.03 CX1.2 42.06,53.14 42.06,57.2 37.59,61.67 | 37.59,61.67 33.83,61.67 32.11,63.4 ATMEGA.31 | 32.11,63.5 ATMEGA.31 | 37.59,61.67 38.2,62.28 38.2,64.01 39.42,65.23 39.42,67.97 40.84,69.39 40.84,72.14 U$1.19 | C5.2 26.21,57.1 32.21,63.09 ATMEGA.31 | USB.GND 8.03,35.66 9.25,36.88 10.46,36.88 13.51,39.93 13.51,41.66 RB.2 13.72,41.76 14.73,42.77 26.11,42.77 26.92,41.96 IC1.4 | IC3.1 46.02,38.61 41.66,38.61 39.93,36.88 C9.2 38.51,36.98 36.98,36.98 32.11,41.86 32,41.86 | C10.1 44.2,42.16 44.2,41.96 46.02,40.13 46.02,38.81 IC3.1 | 49.78,35.05 49.48,35.05 46.02,38.51 IC3.1 | 49.78,35.05 52.63,35.05 53.44,35.87 53.44,36.47 X.2 | 32,41.86 30.18,41.86 CT.2 | RV.2 10.06,9.14 13.51,12.6 14.02,12.6 IC2.1 13.41,12.7 13.41,13.41 11.99,14.83 11.99,22.05 11.89,22.15 | 11.89,22.15 8.03,22.15 CH.2 7.92,22.05 5.99,20.12 3.35,20.12 POWER.1 | 11.89,22.15 12.9,23.16 C0.- | P4.3 76.1,17.98 81.69,12.39 V9.2 81.79,12.19 82.5,11.48 82.5,3.96 RAIN.1 | 48.06,26.42 47.55,26.42 IC5.8 | 48.06,26.42 52.22,22.25 S1.2 | C1.- 22.05,23.27 23.37,24.59 27.43,24.59 CL.2 27.64,24.69 28.14,24.69 | 28.14,24.69 31.5,28.04 31.5,28.96 30.79,29.67 30.79,33.22 D1.A
  Top 0.305: 28.14,24.69 28.96,23.88 28.96,19.1 C2.- | 49.78,35.05 49.78,28.14 48.06,26.42 | v32,41.76 32,41.86
  Top 0.406: V0.2 9.5,9.5 RV.2 | CT.2 27.1,41.88 IC1.4
  Bottom 0.305: BAT1.P$1 61.06,47.04 61.06,49.48 63.09,51.51 67.26,51.51 68.48,52.73 ISP.6 | ENC28J60.11 72.44,34.75 79.96,34.75 ENC28J60.18 | RJ45.Y- 98.86,29.57 95,33.43 91.14,33.43 RJ45.SHIELD0 | 67.8,16.05 74.07,16.05 76,17.98 P4.3 | C0.- 13.01,23.27 21.95,23.27 C1.- | v32,41.76 34.54,44.3 34.54,48.16 ATMEGA.11
  Bottom 0.61: C2.- V1.1 V2.1 V3.1 V4.1 V5.1 V6.1 | V6.1 V7.1 V8.1 67.8,16.05 67.8,12.07 T8.1 65.72,11.55 62.35,11.55 61.57,10.77 T7.1 60.72,11.55 57.2,11.55 56.5,10.85 T6.1 55.72,11.55 52.4,11.55 51.62,10.77 T5.1 50.77,11.5 47.35,11.5 46.62,10.77 T4.1 45.77,11.5 42.4,11.5 41.67,10.77 T3.1 40.77,11.5 37.3,11.5 36.57,10.77 T2.1 35.72,11.55 32.25,11.55 31.5,10.8 T1.1 | V6.1 S1.1 S1.2
  pour Top (isolate 0.813): 0,84 100,84 100,0 0,0
  pour Bottom (isolate 0.813): 0,84 100,84 100,0 0,0
INT0  (via drill 0.3)
  Top 0.203: v44.2,51.31 47.24,48.26 ATMEGA.16 | v33.43,64.52 33.43,65.43 34.24,66.24 34.24,69.6 32,71.83 32,73.46 30.79,74.68 U$1.12
  Bottom 0.203: v44.2,51.31 35.15,60.35 35.05,60.35 33.43,61.98 v33.43,64.52
INT1
  Top 0.203: RZ.2 87.48,11.07 85.04,11.07 77.11,19 77.11,19.2 76.4,19.91 75.59,19.91 74.57,18.9 74.57,16.76 73.97,16.15 73.05,16.15 72.03,17.17 72.03,19.2 70.31,20.93 56.29,20.93 51,26.21 51,27.33 54.05,30.38 55.88,30.38 56.19,30.68 56.19,40.44 53.03,43.59 53.03,45.01 51.92,46.13 51.82,46.13 49.78,48.16 ATMEGA.17
INT2
  Top 0.203: ATMEGA.3 14.22,48.26 14.22,56.39 8.23,62.38 8.23,68.99 16.87,77.62 34.65,77.62 37.08,75.18 37.08,71.83 36.27,71.02 35.36,71.02 34.54,71.83 34.54,73.46 33.33,74.68 U$1.14
LEDA
  Top 0.203: REA.2 89.41,13.92 92.15,11.18 95.71,11.18 98.86,14.33 98.86,18.8 RJ45.G+
LEDB
  Top 0.203: REB.2 85.45,14.02 85.45,16.87 97.84,29.26 97.84,30.99 98.86,32 RJ45.Y+
MISO  (via drill 0.3)
  Top 0.203: v77.32,58.73 77.32,66.45 U1.7 | ATMEGA.7 24.38,48.26 24.38,48.77 10.77,62.38 10.77,70.31 17.27,76.81 32.92,76.81 34.65,75.08 34.65,73.97 35.76,72.85 35.76,72.24 U$1.15 | v37.59,45.92 v49.78,45.92
  Bottom 0.203: v77.32,58.73 77.32,52.43 72.44,47.55 ENC28J60.6 72.44,47.45 74.07,45.82 74.07,44.5 73.46,43.89 70.81,43.89 69.55,45.16 | 69.55,45.16 64.52,50.19 63.5,50.19 ISP.1 | 69.55,45.16 67.77,43.38 61.16,43.38 60.96,43.59 52.12,43.59 v49.78,45.92 | v37.59,45.92 37.39,45.92 35.66,47.65 35.66,49.28 34.65,50.29 26.52,50.29 24.49,48.26 ATMEGA.7
MOSI  (via drill 0.3)
  Top 0.203: v72.95,64.01 72.95,66.45 U1.3 | 10.36,70 10.36,70.51 17.07,77.22 33.33,77.22 35.76,74.78 U$1.16 | 10.36,70 10.36,62.18 21.84,50.7 21.84,48.26 ATMEGA.6 | v54.05,73.36 52.22,73.36 48.16,77.42 35.46,77.42 34.65,78.23 v17.78,78.23 | 10.36,70 v10.16,70
  Bottom 0.203: v72.95,64.01 72.95,62.79 71.37,61.21 | 71.37,61.21 66.04,55.88 66.04,53.85 | 66.04,53.85 66.04,52.83 ISP.4 | 66.04,53.85 68.99,53.85 69.7,53.14 69.7,48.06 72.34,45.41 72.34,45.01 ENC28J60.7 | 71.37,61.21 60.86,71.73 55.68,71.73 v54.05,73.36 | v17.78,78.23 17.78,77.93 10.16,70.31 v10.16,70
N$1
  Top 0.305: X2.2 69.2,36.8 67,36.8 65.8,38 65.8,38.4 65.85,38.45 65.85,39.4 IC4.2
N$2
  Top 0.305: X2.1 69.2,34.25 68.8,34.25 64.6,38.45 64.6,39.4 IC4.1
N$3
  Top 0.305: R1.1 35,18.45 35.45,18 35.45,17 33.55,15.1 33.55,9.64 T1.2
N$4
  Top 0.203: R6.2 44.91,22.86 44.91,24.69 43.79,25.81 43.79,26.42 IC5.5
N$5
  Top 0.203: R7.2 46.94,22.86 46.94,23.98 45.01,25.91 45.01,26.42 IC5.6
N$6
  Bottom 0.305: J2.2 1.93,56.29 1.93,54.86 3.96,52.83 3.96,49.28 1.83,47.14 1.83,17.58 3.25,16.15 POWER.2
N$7
  Top 0.203: R8.2 48.97,22.86 48.97,23.16 46.33,25.81 46.33,26.42 IC5.7
N$8  (via drill 0.3)
  Top 0.203: v67.06,37.69 67.06,39.42 IC4.3
  Bottom 0.203: v67.06,37.69 67.06,36.98 61.06,30.99 BAT1.P$2
N$9
  Top 0.406: IC1.2 27.24,39.2 28.7,39.2 30.57,37.33 D1.C 30.7,37.3 35.6,32.4 35.6,28.56 L1.1
N$10
  Top 0.203: R5.2 42.98,22.86 42.98,25.91 42.47,26.42 IC5.4
N$11
  Top 0.203: R4.2 41.05,22.86 41.05,26.31 41.15,26.42 IC5.3
N$12
  Top 0.203: R3.2 39.01,22.86 39.01,24.99 39.83,25.81 39.83,26.42 IC5.2
N$13
  Top 0.203: R2.2 37.08,22.86 37.08,24.89 38.61,26.42 IC5.1
N$14
  Top 0.203: R1.2 35.05,22.86 35.05,24.18 37.59,26.72 37.59,28.85 39.83,31.09 39.83,32.51 IC5.15
N$15
  Top 0.305: R2.1 37,13.1 38.3,11.8 38.3,9.61 T2.2
N$16
  Top 0.406: V1.2 30.05,14.05 30.05,9.35 31.05,8.35 31.2,8.35 T1.3
  Top 0.61: T1.3 31.5,4.66 S12.1
N$17
  Top 0.406: V2.2 35.05,14.05 35.05,9.35 36.05,8.35 36.2,8.35 T2.3
  Top 0.61: T2.3 36.5,4.74 S12.2
N$18
  Top 0.406: V3.2 40.05,14.05 40.05,9.35 41.05,8.35 41.2,8.35 T3.3
  Top 0.61: T3.3 41.5,4.82 S34.1
N$19
  Top 0.203: RBS.1 69.6,26.52 71.73,26.52 72.34,27.13 ENC28J60.14
N$20
  Top 0.406: V4.2 45.05,14.05 45.05,9.35 46.05,8.35 46.2,8.35 T4.3
  Top 0.61: T4.3 46.5,4.9 S34.2
N$21
  Top 0.305: R3.1 39,20 41.45,17.55 41.45,14.1 43.3,12.25 43.3,9.61 T3.2
N$22
  Top 0.406: V5.2 50.05,14.05 50.05,9.35 51.05,8.35 51.2,8.35 T5.3
  Top 0.61: T5.3 51.5,4.98 S56.1
N$23
  Top 0.406: V6.2 55.05,14.05 55.05,9.35 56.05,8.35 56.2,8.35 T6.3
  Top 0.61: T6.3 56.5,5.06 S56.2
N$24
  Top 0.406: V7.2 60.05,14.05 60.05,9.35 61.05,8.35 61.2,8.35 T7.3
  Top 0.61: T7.3 61.5,5.14 S78.1
N$25
  Top 0.406: T8.3 66.2,8.35 66.05,8.35 64.9,9.5 64.9,13.55 64.25,14.2 V8.2
  Top 0.61: T8.3 66.5,5.22 S78.2
N$26
  Top 0.305: R4.1 41,19 44.4,15.6 45.8,15.6 47.95,13.45 47.95,9.96 T4.2
N$27
  Top 0.305: R5.1 43.3,21.15 48.4,16.05 50.8,16.05 53.25,13.6 53.25,9.65 T5.2
N$28
  Top 0.305: R6.1 46.95,19.2 49.95,19.2 53.25,15.9 55.5,15.9 58.3,13.1 58.3,9.61 T6.2
N$29
  Top 0.305: R7.1 47.2,21.15 48.45,19.9 52.05,19.9 52.8,19.15 55,19.15 58.2,15.95 60.85,15.95 63.15,13.65 63.15,9.76 T7.2
N$31
  Top 0.203: 87.22,8.79 87.17,8.74 85.34,8.74 V9.1 | 87.22,8.79 89.41,10.97 RZ.1 | 87.22,8.79 87.58,8.43 87.58,3.96 RAIN.2
N$32
  Bottom 0.305: F0.1 5.99,5.08 5.99,8.53 4.67,9.86 4.67,28.55 3.25,29.97 3.25,47.75 4.47,48.97 4.47,55.37 2.34,57.51 1.52,57.51 0.81,56.79 0.81,54.36 1.83,53.34 J2.3
N$33
  Top 0.203: CAP.1 69.09,58.01 70.21,58.01 72.34,60.15 ENC28J60.1
N$34  (via drill 0.3)
  Top 0.203: v84.53,20.52 84.53,13.31 84.73,13.11 85.95,13.11 86.77,13.92 87.58,13.92 REA.1
  Bottom 0.203: v84.53,20.52 84.53,21.34 82.09,23.77 82.09,55.58 80.06,57.61 ENC28J60.27
N$35
  Top 0.203: Q1.3 62.99,58.12 62.99,60.45 61.98,61.47 DF.A 61.87,61.57 57.4,66.04 57.4,73.46 RELAY.9
N$37
  Top 0.203: REB.1 83.62,14.02 83.62,19.91 76.91,26.62 76.91,52.02 79.96,55.07 ENC28J60.26
N$38
  Top 0.305: IC1.6 19.36,40.63 19.3,40.7 16.65,40.7 15.4,39.45 15.4,38.02 DZ.A
  Top 0.61: DZ.A 15.38,37.62 RSC.2 RSC1.2
N$39
  Top 0.406: RV.1 13.8,9.1 D2.A
N$40
  Top 0.203: RQ.1 65.94,57.81 64.41,57.81 63.6,57 62.99,57 62.08,56.08 Q1.1
N$41
  Top 0.203: CX3.1 85.85,55.98 85.85,52.32 85.04,51.51 X1.2 84.94,51.41 83.62,50.09 80.06,50.09 ENC28J60.24
N$42
  Top 0.203: CX4.1 85.85,42.06 85.85,45.72 85.04,46.53 X1.1 84.94,46.63 84.12,47.45 80.06,47.45 ENC28J60.23
N$43
  Top 0.305: R8.1 50.3,21.15 50.75,20.7 55.3,20.7 56.6,19.4 59.75,19.4 62.9,16.25 64.6,16.25 68.35,12.5 68.35,9.55 T8.2
N$44
  Top 0.305: X.1 52.3,37.4 52.4,37.5 52.75,37.5 53.15,37.9 53.65,37.9 53.7,37.95 53.7,38.7 IC3.7
N$45
  Top 0.406: IC1.7 IC1.8 IC1.1
  Top 0.61: RSC1.1 RSC.1 20.93,35.93 IC1.8
N$46
  Top 0.203: X0.2 40.95,56.79 40.13,55.98 40.13,53.03 CX1.1 40.03,52.93 37.19,50.09 37.19,48.26 ATMEGA.12
N$47
  Top 0.203: X0.1 45.82,56.79 45.82,53.03 CX2.1 45.72,53.03 44.81,52.12 44.09,52.12 40.23,48.26 39.73,48.26 ATMEGA.13
N$48
  Top 0.305: X.3 54.7,37.45 54.95,37.7 IC3.8
N$49
  Top 0.406: IC1.3 29.49,40.63 CT.1
N$54
  Top 0.203: RR-.2 91.95,46.94 91.95,44.09 C6.2 91.95,43.99 91.95,41.05 RR+.1
N$55
  Top 0.305: RB.1 RT.2
  Top 0.406: RT.2 20.72,41.7 IC1.5
NC
  Bottom 0.61: RELAY.1 84.38,81.12 JC.1
NO
  Bottom 0.61: JO.1 60.9,72.5 RELAY.10
QH*  (via drill 0.3)
  Top 0.203: v45.21,28.04 47.45,30.28 47.45,32.51 IC5.9 | v22.15,24.99 20.83,23.67 20.83,21.54 29.46,12.9 29.46,4.17 31.09,2.54 88.19,2.54 92.76,7.11 EXTOUT.2
  Bottom 0.203: v45.21,28.04 36.47,28.04 33.43,24.99 v22.15,24.99
RD+  (via drill 0.3)
  Top 0.203: v84.23,32.41 84.23,37.69 87.48,40.95 89.92,40.95 RR+.2 | v83.11,25.3 v79.76,25.3
  Bottom 0.203: v84.23,32.41 86.56,30.07 86.56,26.01 | 86.56,26.01 86.56,24.69 87.58,23.67 RJ45.RD+ | v79.76,25.3 75.39,29.67 72.44,29.67 ENC28J60.13 | v83.11,25.3 84.02,25.3 84.73,26.01 86.56,26.01
RD-  (via drill 0.3)
  Top 0.203: RR-.1 90.02,46.94 90.02,45.62 91.03,44.6 91.03,37.29 96.22,32.11 96.22,30.38 93.27,27.43 85.14,27.43 RJ45.RD- 85.04,27.43 81.79,30.68 79.45,30.68 v77.93,32.21
  Bottom 0.203: v77.93,32.21 72.44,32.21 ENC28J60.12
RECAC
  Top 0.61: DZ.C 15,28.78 C0.+ 10.9,26.78 CH.1 8,24.02 D0.C
RESET
  Top 0.203: C11.2 31.09,45.01 31.09,46.63 29.57,48.16 ATMEGA.9 29.46,48.26 29.46,49.78 28.96,50.29 28.25,50.29 24.49,54.05 23.67,54.05 RR.2 | S1.4 52.32,26.82 58.73,26.82 S1.3 58.83,26.82 62.69,26.82 69.09,33.22 69.6,33.22 70.71,34.34 70.71,35.56 72.34,37.19 ENC28J60.10 72.34,37.39 72.34,37.8 69.7,40.44 69.7,49.07 68.58,50.19 ISP.5
  Bottom 0.203: ATMEGA.9 29.57,48.16 29.57,42.67 35.56,36.68 47.75,36.68 49.89,38.81 53.85,38.81 55.88,40.84 73.46,40.84 74.07,40.23 74.07,39.01 72.44,37.39 ENC28J60.10
RTS  (via drill 0.3)
  Top 0.203: v36.68,45.01 32.92,45.01 C11.1 | v44.5,45.01 45.41,45.01 45.62,45.21 47.75,45.21 48.56,44.4 IC3.14
  Bottom 0.203: v44.5,45.01 v36.68,45.01
RXD  (via drill 0.3)
  Top 0.203: v47.24,41.76 47.24,38.71 IC3.2 | v29.46,67.06 29.46,68.89 27.03,71.32 27.03,72.64 28.14,73.76 28.14,74.68 U$1.10
  Bottom 0.203: v47.24,41.76 47.24,43.18 42.27,48.16 ATMEGA.14 42.16,48.26 42.16,48.46 31.09,59.54 31.09,64.01 29.46,65.63 v29.46,67.06
SCK  (via drill 0.3)
  Top 0.203: 67.72,58.47 67.46,58.22 67.46,52.32 66.04,50.9 66.04,50.29 ISP.3 | 67.72,58.47 70.41,61.16 74.27,61.16 75.08,61.98 75.08,66.45 U1.5 | v70.31,45.92 70.31,44.91 72.34,42.88 72.34,42.47 ENC28J60.8 | v37.59,44.09 30.48,44.09 27.03,47.55 27.03,48.16 ATMEGA.8 | v67.67,58.52 67.72,58.47
  Bottom 0.203: v70.31,45.92 66.04,50.19 ISP.3 | v37.59,44.09 40.13,44.09 45.01,39.22 53.65,39.22 55.88,41.45 71.42,41.45 72.34,42.37 ENC28J60.8 | v67.67,58.52 55.37,70.81 35.56,70.81 34.24,72.14 33.33,72.14 U$1.13
SCL  (via drill 0.3)
  Top 0.203: IC7.1 15.04,70.31 18.69,70.31 20.52,72.14 U$1.3 20.62,72.14 21.54,72.14 24.08,69.6 v26.31,69.6 | ATMEGA.22 54.86,63.4 54.86,62.99 53.95,62.08 53.95,57.1 RCL.2 54.05,57.1 v54.86,56.29 | v64.72,52.22 64.72,49.99 67.06,47.65 67.06,45.62 IC4.6
  Bottom 0.203: v64.72,52.22 64.72,53.03 61.47,56.29 58.93,56.29 | v54.86,56.29 58.93,56.29 | v26.31,69.6 31.39,69.6 32.21,70.41 55.07,70.41 58.93,66.55 58.93,56.29
SDA  (via drill 0.3)
  Top 0.203: IC7.3 13.11,70.31 13.11,71.42 17.68,76 18.49,76 19.3,75.18 19.3,73.46 18.09,72.24 U$1.1 | v45.82,73.15 48.97,70 50.39,70 52.32,68.07 52.32,63.5 ATMEGA.23 52.32,63.4 51.31,62.38 51.31,53.34 51.51,53.14 52.83,53.14 52.88,53.19 | 52.88,53.19 53.65,53.95 53.85,53.95 RDA.2 | v67.36,43.99 68.38,45.01 68.38,45.52 IC4.5 | 52.88,53.19 v53.03,53.03
  Bottom 0.203: v45.82,73.15 42.06,76.91 18.59,76.91 16.87,75.18 16.87,74.27 17.98,73.15 17.98,72.24 U$1.1 | v67.36,43.99 59.23,43.99 55.98,47.24 55.98,50.09 v53.03,53.03
TCT  (via drill 0.3)
  Top 0.203: C7.2 91.95,57 v91.95,55.88 91.95,54.05 RT+.1 | L2.1 85.95,60.05 86.97,61.06 90.63,61.06 91.64,60.05 91.95,60.05 RT-.2 91.95,59.94 v91.95,58.73 | v96.62,39.73 96.62,30.18 91.34,24.89 85.14,24.89 RJ45.P4
  Bottom 0.203: v91.95,58.73 v91.95,55.88 91.95,44.4 v96.62,39.73
TD+
  Top 0.203: 78.49,33.78 79.96,32.31 ENC28J60.17 | 78.49,33.78 78.33,33.93 78.33,47.85 78.94,48.46 83.52,48.46 89,53.95 89.92,53.95 RT+.2 | 78.49,33.78 77.32,32.61 77.32,26.82 83.01,21.13 87.58,21.13 RJ45.TD+
TD-  (via drill 0.3)
  Top 0.203: v89.92,58.12 89.92,59.94 RT-.1 | ENC28J60.16 80.06,29.67 80.06,29.26 84.02,25.3 84.02,23.37 85.04,22.35 RJ45.TD-
  Bottom 0.203: v89.92,58.12 89.92,43.38 82.5,35.97 82.5,24.89 85.04,22.35 RJ45.TD-
TXD  (via drill 0.3)
  Top 0.203: v48.56,40.44 48.56,38.71 IC3.3 | v32,68.07 28.25,71.83 28.25,72.14 U$1.9
  Bottom 0.203: v48.56,40.44 48.56,44.4 44.81,48.16 ATMEGA.15 44.81,48.26 44.81,51.61 44.5,51.92 44.4,51.92 36.17,60.15 36.17,64.01 35.05,65.13 33.33,65.13 32,66.45 v32,68.07
VCC  (via drill 0.3, 0.6)
  Top 0.203: U1.4 73.97,66.45 73.86,66.34 73.86,63.09 RSD.2 73.86,62.99 73.86,62.08 v74.07,61.87 | L2.2 84.02,60.05 80.16,60.05 80.06,60.15 ENC28J60.28 | ENC28J60.20 80.06,39.83 80.06,37.39 ENC28J60.19 | 41.35,36.78 40.54,36.78 39.01,35.26 38.71,35.26 C9.1 | 41.35,36.78 42.47,36.78 ROE.2 42.57,36.78 42.88,36.78 46.33,33.33 IC5.10 46.33,32.61 46.33,33.22 47.04,33.93 47.14,33.93 v47.95,34.75 | v49.38,36.17 49.73,36.52 | 49.73,36.52 49.78,36.58 49.78,38.61 IC3.4 | IC5.16 38.61,32.51 38.61,30.48 36.58,28.45 36.58,26.31 30.07,19.81 30.07,18.59 29.46,17.98 28.04,17.98 27.03,19 C2.+ | U$1.6 23.06,74.78 22.25,74.78 20.62,76.4 17.48,76.4 12.39,71.32 12.39,68.38 13.01,67.77 IC7.4 13.11,67.67 13.11,62.08 18.09,57.1 RPR.2 18.19,57 21.03,54.15 21.95,54.15 RR.1 22.05,54.05 26.21,49.89 28.45,49.89 v28.65,49.68 | ATMEGA.30 34.65,63.5 34.65,68.48 38.3,72.14 U$1.17 | C5.1 27.94,57 27.94,54.05 C3.1 28.04,54.05 30.89,54.05 30.94,54 | 35.66,46.53 33.73,46.53 32.11,48.16 ATMEGA.10 | 35.66,46.53 36.07,46.53 38.51,44.09 44.09,44.09 C10.2 | 30.94,54 35.66,49.28 35.66,46.53 | v35.36,60.96 35.36,58.42 30.94,54 | v41.35,37.29 41.35,36.78 | v51.41,35.76 50.49,35.76 49.73,36.52
  Top 0.305: IC5.16 38.65,32.6 38.65,35.15 38.6,35.15 C9.1 | C10.2 44.15,44 46.05,44 IC3.16
  Top 0.61: v10.9,19 7.9,16 IC2.4
  Bottom 0.203: 78.38,58.57 79.96,60.15 ENC28J60.28 | 78.38,58.57 78.33,58.52 78.33,54.66 79.96,53.03 79.96,52.63 ENC28J60.25 79.96,52.43 79.96,52.02 78.33,50.39 78.33,41.55 79.96,39.93 ENC28J60.20 | v74.07,61.87 75.08,61.87 78.38,58.57 | EXTOUT.1 95.2,7.21 95.2,8.23 93.88,9.55 93.88,10.16 92.86,11.18 92.25,11.18 80.37,23.06 80.37,26.82 80.06,27.13 ENC28J60.15 80.06,27.23 80.06,27.64 81.69,29.26 81.69,35.66 80.06,37.29 ENC28J60.19 79.96,37.29 74.47,37.29 73.46,36.27 71.12,36.27 69.09,38.3 56.49,38.3 53.95,35.76 v51.41,35.76 | v47.95,34.75 v49.38,36.17 | v35.36,60.96 34.65,61.67 34.65,63.4 ATMEGA.30 | v28.65,49.68 28.96,49.68 29.16,49.89 30.38,49.89 32,48.26 ATMEGA.10 32,48.16 31.39,47.55 31.39,41.45 35.56,37.29 v41.35,37.29
  Bottom 0.61: v10.9,19 C2.+
VIN  (via drill 0.3)
  Top 0.305: v70.31,42.06 71.02,41.35 72.95,41.35 74.07,40.23 74.07,26.72 73.56,26.21 73.56,18.09 P4.2 | v67.46,42.06 64.72,44.81 64.72,45.52 IC4.8 64.29,45.88 C8.1 62.28,46.02 62.28,51.51 63.4,52.63 ISP.2 63.5,52.83 64.31,52.83 66.95,55.47 66.95,58.52 66.04,59.44 66.04,61.47 DF.C 65.94,61.57 65.94,64.62 58.52,72.03 58.52,73.97 57.4,75.08 57.3,75.08 | USB.VBUS 10.06,35.56 15.14,35.56 16.87,33.83 16.87,18.49 15.95,17.58 15.95,17.27 15.9,17.1 | RDA.1 52.22,54.05 52.22,57 RCL.1 52.32,57.1 52.32,61.16 53.54,62.38 53.54,67.26 LCD.15 53.54,67.46 53.54,71.32 | 57.3,75.08 57.3,81.08 RELAY.2 | 53.54,71.32 57.3,75.08 | 53.54,71.32 48.87,76 40.44,76 39.22,74.78 38.41,74.78 U$1.18
  Top 0.406: D2.C 18.5,10.2 F1.2 18.35,12.95 16.05,15.25 16.05,16.95 15.9,17.1 14.31,17.1 IC2.3
  Bottom 0.305: v67.46,42.06 v70.31,42.06 | U$1.18 38.3,74.78 37.08,76 22.55,76 21.03,74.47 U$1.4 20.62,74.68 21.84,73.46 21.84,71.73 20.62,70.51 20.62,67.36 LCD.2 20.52,67.16 18.29,64.92 18.29,62.69 15.75,60.15 15.75,42.16 10.06,36.47 10.06,35.66 USB.VBUS
VIN1
  Top 0.305: RT.1 18,37.05 19,36.05 19,29.78 C1.+
  Top 0.406: L1.2 29.62,28.5 CL.1 22.4,26.38 C1.+
  Top 0.61: C1.+ 21.88,26.78 19.1,24 19.1,17.65 F1.1

### Text on the board
tNames: OpenSprinkler DIY v2.2u | NC | (Rev. Nov/14) | http://www.opensprinkler.com | GND VIN VCC A6 RXD INT0 INT2 MSI VIN | CO | NO | SDA SCL A5 A7 TXD D15 SCK MSO VCC GND | ISP | RESET | POWER | A3 VIN GND | RF | EXTOUT | COM | Rain | S1-8
BoxDim: Serpac WM-032C Enclosure | All units are in inch | Left | Right | Front | Bottom